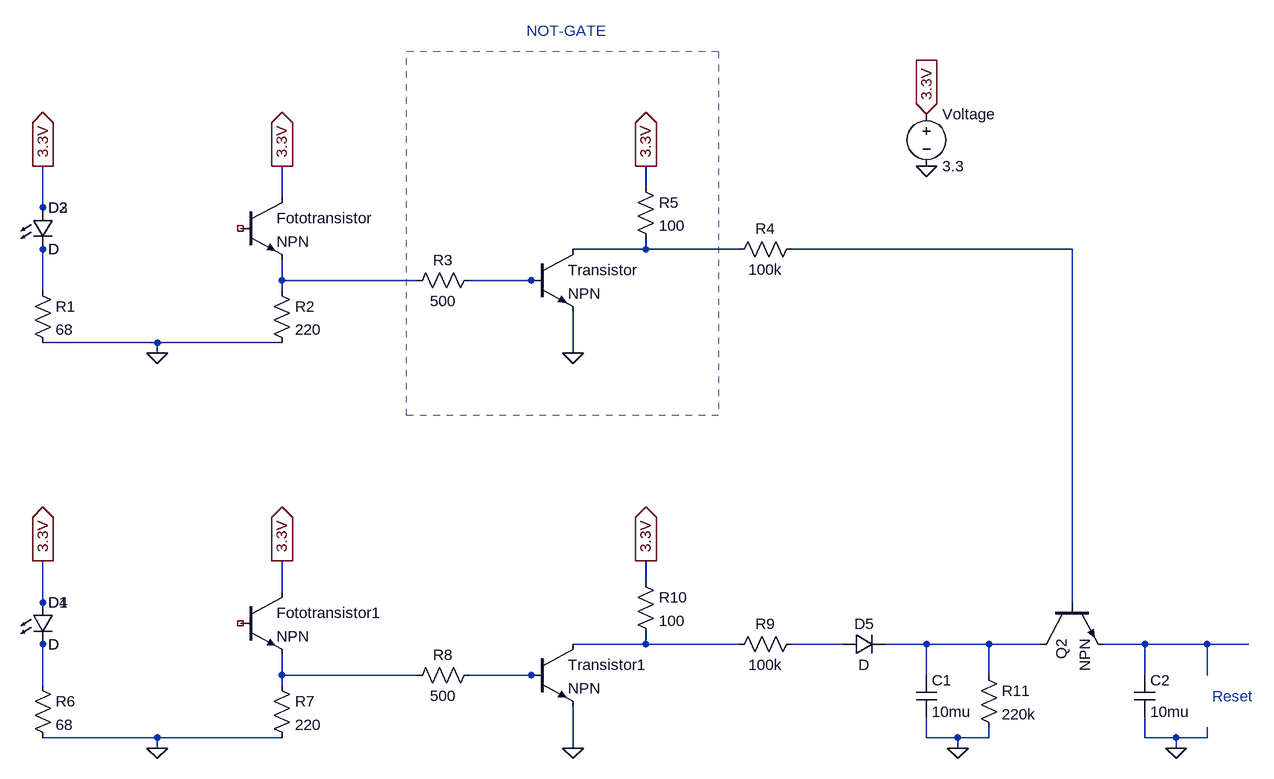
[diagram p0: schematic Lichtschranke.asc]
Lichtschranke.asc, the LTspice schematic file:
Version 4
SHEET 1 1488 884
WIRE 544 0 544 -32
WIRE -16 16 -16 -32
WIRE -384 32 -384 -32
WIRE 544 96 544 80
WIRE 544 96 432 96
WIRE 688 96 544 96
WIRE 1200 96 768 96
WIRE -16 144 -16 112
WIRE 192 144 -16 144
WIRE 368 144 272 144
WIRE 384 144 368 144
WIRE -384 160 -384 96
WIRE -16 160 -16 144
WIRE -208 240 -384 240
WIRE -16 240 -208 240
WIRE -208 256 -208 240
WIRE 432 256 432 192
WIRE 544 608 544 576
WIRE -16 624 -16 576
WIRE -384 640 -384 576
WIRE 1200 640 1200 96
WIRE 544 704 544 688
WIRE 544 704 432 704
WIRE 688 704 544 704
WIRE 848 704 768 704
WIRE 976 704 912 704
WIRE 1072 704 976 704
WIRE 1152 704 1072 704
WIRE 1312 704 1248 704
WIRE 1408 704 1312 704
WIRE 1472 704 1408 704
WIRE -16 752 -16 720
WIRE 192 752 -16 752
WIRE 368 752 272 752
WIRE 384 752 368 752
WIRE 976 752 976 704
WIRE 1072 752 1072 704
WIRE 1312 752 1312 704
WIRE 1408 752 1408 704
WIRE -384 768 -384 704
WIRE -16 768 -16 752
WIRE -208 848 -384 848
WIRE -16 848 -208 848
WIRE 976 848 976 816
WIRE 1024 848 976 848
WIRE 1072 848 1072 832
WIRE 1072 848 1024 848
WIRE 1312 848 1312 816
WIRE 1360 848 1312 848
WIRE 1408 848 1408 832
WIRE 1408 848 1360 848
WIRE -208 864 -208 848
WIRE 432 864 432 800
WIRE 1024 864 1024 848
WIRE 1360 864 1360 848
FLAG 976 -112 3.3V
IOPIN 976 -112 In
FLAG 976 -32 0
FLAG -384 -32 3.3V
IOPIN -384 -32 Out
FLAG -16 -32 3.3V
IOPIN -16 -32 Out
FLAG -208 256 0
FLAG 432 256 0
FLAG 544 -32 3.3V
IOPIN 544 -32 Out
FLAG -384 576 3.3V
IOPIN -384 576 Out
FLAG -16 576 3.3V
IOPIN -16 576 Out
FLAG -208 864 0
FLAG 432 864 0
FLAG 544 576 3.3V
IOPIN 544 576 Out
FLAG 1024 864 0
FLAG 1360 864 0
SYMBOL voltage 976 -128 R0
WINDOW 123 0 0 Left 0
WINDOW 39 0 0 Left 0
SYMATTR InstName Voltage
SYMATTR Value 3.3
SYMBOL res -400 144 R0
SYMATTR InstName R1
SYMATTR Value 68
SYMBOL res -32 144 R0
SYMATTR InstName R2
SYMATTR Value 220
SYMBOL res 288 128 R90
WINDOW 0 0 56 VBottom 2
WINDOW 3 32 56 VTop 2
SYMATTR InstName R3
SYMATTR Value 500
SYMBOL LED -400 32 R0
SYMATTR InstName D2
SYMBOL LED -400 32 R0
SYMATTR InstName D3
SYMBOL npn -80 16 R0
SYMATTR InstName Fototransistor
SYMBOL npn 368 96 R0
SYMATTR InstName Transistor
SYMBOL res 784 80 R90
WINDOW 0 0 56 VBottom 2
WINDOW 3 32 56 VTop 2
SYMATTR InstName R4
SYMATTR Value 100k
SYMBOL res 528 -16 R0
SYMATTR InstName R5
SYMATTR Value 100
SYMBOL res -400 752 R0
SYMATTR InstName R6
SYMATTR Value 68
SYMBOL res -32 752 R0
SYMATTR InstName R7
SYMATTR Value 220
SYMBOL res 288 736 R90
WINDOW 0 0 56 VBottom 2
WINDOW 3 32 56 VTop 2
SYMATTR InstName R8
SYMATTR Value 500
SYMBOL LED -400 640 R0
SYMATTR InstName D1
SYMBOL LED -400 640 R0
SYMATTR InstName D4
SYMBOL npn -80 624 R0
SYMATTR InstName Fototransistor1
SYMBOL npn 368 704 R0
SYMATTR InstName Transistor1
SYMBOL res 784 688 R90
WINDOW 0 0 56 VBottom 2
WINDOW 3 32 56 VTop 2
SYMATTR InstName R9
SYMATTR Value 100k
SYMBOL res 528 592 R0
SYMATTR InstName R10
SYMATTR Value 100
SYMBOL diode 848 720 R270
WINDOW 0 32 32 VTop 2
WINDOW 3 0 32 VBottom 2
SYMATTR InstName D5
SYMBOL cap 960 752 R0
SYMATTR InstName C1
SYMATTR Value 10mu
SYMBOL res 1056 736 R0
SYMATTR InstName R11
SYMATTR Value 220k
SYMBOL npn 1152 640 M90
SYMATTR InstName Q2
SYMBOL cap 1296 752 R0
SYMATTR InstName C2
SYMATTR Value 10mu
TEXT 1416 784 Left 2 ;Reset
TEXT 360 -240 Left 2 ;NOT-GATE
LINE Normal 176 352 176 -208 2
LINE Normal 656 352 176 352 2
LINE Normal 656 -208 656 352 2
LINE Normal 656 -208 176 -208 2

The netlist it stands for:
* Lichtschranke.asc
Voltage 3.3V 0 3.3
R1 N005 0 68
R2 N003 0 220
R3 N004 N003 500
D2 3.3V N005 D
D3 3.3V N005 D
Q§Fototransistor 3.3V NC_01 N003 0 NPN
Q§Transistor N001 N004 0 0 NPN
R4 N002 N001 100k
R5 3.3V N001 100
R6 N012 0 68
R7 N010 0 220
R8 N011 N010 500
D1 3.3V N012 D
D4 3.3V N012 D
Q§Fototransistor1 3.3V NC_02 N010 0 NPN
Q§Transistor1 N006 N011 0 0 NPN
R9 N007 N006 100k
R10 3.3V N006 100
D5 N007 N008 D
C1 N008 0 10mu
R11 N008 0 220k
Q2 N008 N002 N009 0 NPN
C2 N009 0 10mu
.model D D
.lib standard.dio
.model NPN NPN
.model PNP PNP
.lib standard.bjt
* Reset
* NOT-GATE
.backanno
.end